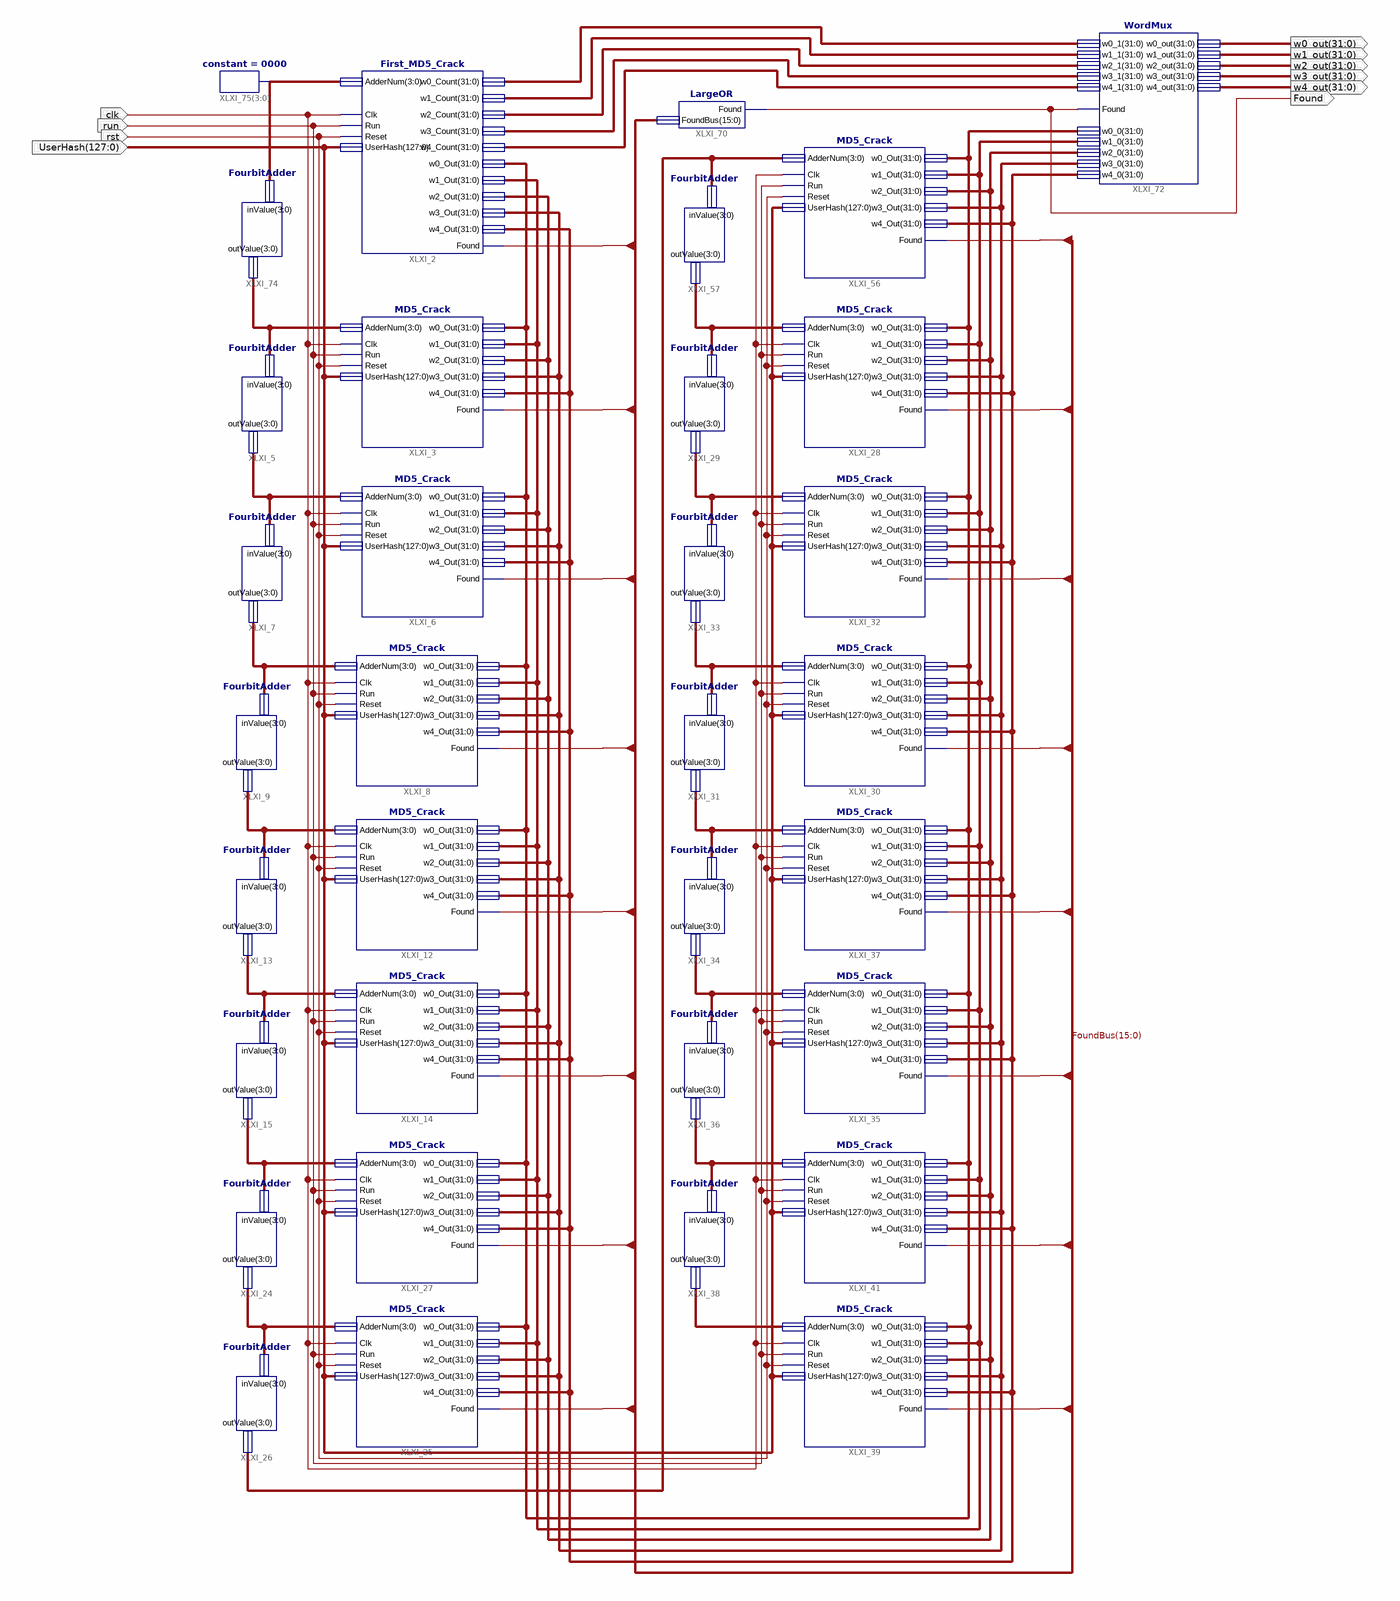
[diagram p0: schematic sheet 1]
// Xilinx ISE schematic MD5_Toplevel_FPGA.sch (zynq) as structural Verilog: 34 symbols, 10 ports
module MD5_Toplevel_FPGA (
  input  clk,
  input  run,
  input  rst,
  input  [127:0] UserHash,
  output Found,
  output [31:0] w0_out,
  output [31:0] w1_out,
  output [31:0] w2_out,
  output [31:0] w3_out,
  output [31:0] w4_out
);

  wire [3:0] XLXN_2, XLXN_3, XLXN_4, XLXN_5, XLXN_6, XLXN_7, XLXN_8, XLXN_9, XLXN_11, XLXN_12, XLXN_13,
       XLXN_14, XLXN_15, XLXN_16, XLXN_17, XLXN_79;
  wire [15:0] FoundBus;
  wire [31:0] XLXN_19, XLXN_20, XLXN_21, XLXN_22, XLXN_23, XLXN_66, XLXN_67, XLXN_75, XLXN_77, XLXN_78;

  First_MD5_Crack XLXI_2 (
    .AdderNum(XLXN_79), .Run(run), .Reset(rst), .Clk(clk), .UserHash(UserHash), .w0_Out(XLXN_19),
    .w1_Out(XLXN_20), .w2_Out(XLXN_21), .w3_Out(XLXN_22), .w4_Out(XLXN_23), .Found(FoundBus[0]),
    .w0_Count(XLXN_78), .w1_Count(XLXN_77), .w2_Count(XLXN_75), .w3_Count(XLXN_67), .w4_Count(XLXN_66));
  MD5_Crack XLXI_3 (
    .AdderNum(XLXN_2), .Reset(rst), .Clk(clk), .Run(run), .UserHash(UserHash), .Found(FoundBus[1]),
    .w0_Out(XLXN_19), .w3_Out(XLXN_22), .w2_Out(XLXN_21), .w4_Out(XLXN_23), .w1_Out(XLXN_20));
  FourbitAdder XLXI_5 (.inValue(XLXN_2), .outValue(XLXN_3));
  MD5_Crack XLXI_8 (
    .AdderNum(XLXN_4), .Reset(rst), .Clk(clk), .Run(run), .UserHash(UserHash), .Found(FoundBus[3]),
    .w0_Out(XLXN_19), .w3_Out(XLXN_22), .w2_Out(XLXN_21), .w4_Out(XLXN_23), .w1_Out(XLXN_20));
  FourbitAdder XLXI_9 (.inValue(XLXN_4), .outValue(XLXN_5));
  MD5_Crack XLXI_6 (
    .AdderNum(XLXN_3), .Reset(rst), .Clk(clk), .Run(run), .UserHash(UserHash), .Found(FoundBus[2]),
    .w0_Out(XLXN_19), .w3_Out(XLXN_22), .w2_Out(XLXN_21), .w4_Out(XLXN_23), .w1_Out(XLXN_20));
  FourbitAdder XLXI_7 (.inValue(XLXN_3), .outValue(XLXN_4));
  FourbitAdder XLXI_13 (.inValue(XLXN_5), .outValue(XLXN_6));
  MD5_Crack XLXI_14 (
    .AdderNum(XLXN_6), .Reset(rst), .Clk(clk), .Run(run), .UserHash(UserHash), .Found(FoundBus[5]),
    .w0_Out(XLXN_19), .w3_Out(XLXN_22), .w2_Out(XLXN_21), .w4_Out(XLXN_23), .w1_Out(XLXN_20));
  FourbitAdder XLXI_15 (.inValue(XLXN_6), .outValue(XLXN_7));
  MD5_Crack XLXI_12 (
    .AdderNum(XLXN_5), .Reset(rst), .Clk(clk), .Run(run), .UserHash(UserHash), .Found(FoundBus[4]),
    .w0_Out(XLXN_19), .w3_Out(XLXN_22), .w2_Out(XLXN_21), .w4_Out(XLXN_23), .w1_Out(XLXN_20));
  FourbitAdder XLXI_24 (.inValue(XLXN_7), .outValue(XLXN_8));
  MD5_Crack XLXI_25 (
    .AdderNum(XLXN_8), .Reset(rst), .Clk(clk), .Run(run), .UserHash(UserHash), .Found(FoundBus[7]),
    .w0_Out(XLXN_19), .w3_Out(XLXN_22), .w2_Out(XLXN_21), .w4_Out(XLXN_23), .w1_Out(XLXN_20));
  FourbitAdder XLXI_26 (.inValue(XLXN_8), .outValue(XLXN_9));
  MD5_Crack XLXI_27 (
    .AdderNum(XLXN_7), .Reset(rst), .Clk(clk), .Run(run), .UserHash(UserHash), .Found(FoundBus[6]),
    .w0_Out(XLXN_19), .w3_Out(XLXN_22), .w2_Out(XLXN_21), .w4_Out(XLXN_23), .w1_Out(XLXN_20));
  MD5_Crack XLXI_28 (
    .AdderNum(XLXN_11), .Reset(rst), .Clk(clk), .Run(run), .UserHash(UserHash), .Found(FoundBus[9]),
    .w0_Out(XLXN_19), .w3_Out(XLXN_22), .w2_Out(XLXN_21), .w4_Out(XLXN_23), .w1_Out(XLXN_20));
  FourbitAdder XLXI_29 (.inValue(XLXN_11), .outValue(XLXN_12));
  MD5_Crack XLXI_32 (
    .AdderNum(XLXN_12), .Reset(rst), .Clk(clk), .Run(run), .UserHash(UserHash), .Found(FoundBus[10]),
    .w0_Out(XLXN_19), .w3_Out(XLXN_22), .w2_Out(XLXN_21), .w4_Out(XLXN_23), .w1_Out(XLXN_20));
  FourbitAdder XLXI_33 (.inValue(XLXN_12), .outValue(XLXN_13));
  MD5_Crack XLXI_56 (
    .AdderNum(XLXN_9), .Reset(rst), .Clk(clk), .Run(run), .UserHash(UserHash), .Found(FoundBus[8]),
    .w0_Out(XLXN_19), .w3_Out(XLXN_22), .w2_Out(XLXN_21), .w4_Out(XLXN_23), .w1_Out(XLXN_20));
  FourbitAdder XLXI_57 (.inValue(XLXN_9), .outValue(XLXN_11));
  MD5_Crack XLXI_30 (
    .AdderNum(XLXN_13), .Reset(rst), .Clk(clk), .Run(run), .UserHash(UserHash), .Found(FoundBus[11]),
    .w0_Out(XLXN_19), .w3_Out(XLXN_22), .w2_Out(XLXN_21), .w4_Out(XLXN_23), .w1_Out(XLXN_20));
  FourbitAdder XLXI_31 (.inValue(XLXN_13), .outValue(XLXN_14));
  MD5_Crack XLXI_37 (
    .AdderNum(XLXN_14), .Reset(rst), .Clk(clk), .Run(run), .UserHash(UserHash), .Found(FoundBus[12]),
    .w0_Out(XLXN_19), .w3_Out(XLXN_22), .w2_Out(XLXN_21), .w4_Out(XLXN_23), .w1_Out(XLXN_20));
  FourbitAdder XLXI_34 (.inValue(XLXN_14), .outValue(XLXN_15));
  MD5_Crack XLXI_35 (
    .AdderNum(XLXN_15), .Reset(rst), .Clk(clk), .Run(run), .UserHash(UserHash), .Found(FoundBus[13]),
    .w0_Out(XLXN_19), .w3_Out(XLXN_22), .w2_Out(XLXN_21), .w4_Out(XLXN_23), .w1_Out(XLXN_20));
  FourbitAdder XLXI_36 (.inValue(XLXN_15), .outValue(XLXN_16));
  MD5_Crack XLXI_41 (
    .AdderNum(XLXN_16), .Reset(rst), .Clk(clk), .Run(run), .UserHash(UserHash), .Found(FoundBus[14]),
    .w0_Out(XLXN_19), .w3_Out(XLXN_22), .w2_Out(XLXN_21), .w4_Out(XLXN_23), .w1_Out(XLXN_20));
  FourbitAdder XLXI_38 (.inValue(XLXN_16), .outValue(XLXN_17));
  MD5_Crack XLXI_39 (
    .AdderNum(XLXN_17), .Reset(rst), .Clk(clk), .Run(run), .UserHash(UserHash), .Found(FoundBus[15]),
    .w0_Out(XLXN_19), .w3_Out(XLXN_22), .w2_Out(XLXN_21), .w4_Out(XLXN_23), .w1_Out(XLXN_20));
  LargeOR XLXI_70 (.FoundBus(FoundBus), .Found(Found));
  WordMux XLXI_72 (
    .w4_0(XLXN_23), .w3_0(XLXN_22), .w2_0(XLXN_21), .w1_0(XLXN_20), .w0_0(XLXN_19), .Found(Found),
    .w4_1(XLXN_66), .w3_1(XLXN_67), .w2_1(XLXN_75), .w1_1(XLXN_77), .w0_1(XLXN_78), .w1_out(w1_out),
    .w0_out(w0_out), .w2_out(w2_out), .w3_out(w3_out), .w4_out(w4_out));
  FourbitAdder XLXI_74 (.inValue(XLXN_79), .outValue(XLXN_2));
  constant #(.CValue("0000")) XLXI_75[3:0] (.O(XLXN_79));

  // Notes on the sheet:
  //   KEEP on signal clk = 
endmodule
